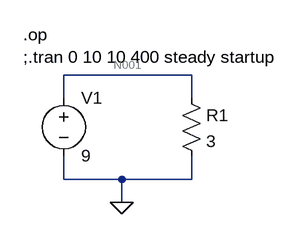
[diagram p0: schematic Draft4.asc]
Draft4.asc, the LTspice schematic file:
Version 4.1
SHEET 1 880 680
WIRE 208 32 32 32
WIRE 32 64 32 32
WIRE 208 64 208 32
WIRE 32 176 32 144
WIRE 112 176 32 176
WIRE 208 176 208 144
WIRE 208 176 112 176
WIRE 112 208 112 176
FLAG 112 208 0
SYMBOL voltage 32 48 R0
SYMATTR InstName V1
SYMATTR Value 9
SYMBOL res 192 48 R0
SYMATTR InstName R1
SYMATTR Value 3
TEXT -24 -24 Left 2 !.op\n;.tran 0 10 10 400 steady startup

The netlist it stands for:
* Draft4.asc
V1 N001 0 9
R1 N001 0 3
.op
;.tran 0 10 10 400 steady startup
.backanno
.end

* Results of the author's LTspice run, read from the files saved beside the schematic
* Operating Point:
*   V(n001) = 9 V
*   I(R1) = 3 A
*   I(V1) = -3 A